# EAGLE design PCB FINAL (EAGLE 9.5.1)
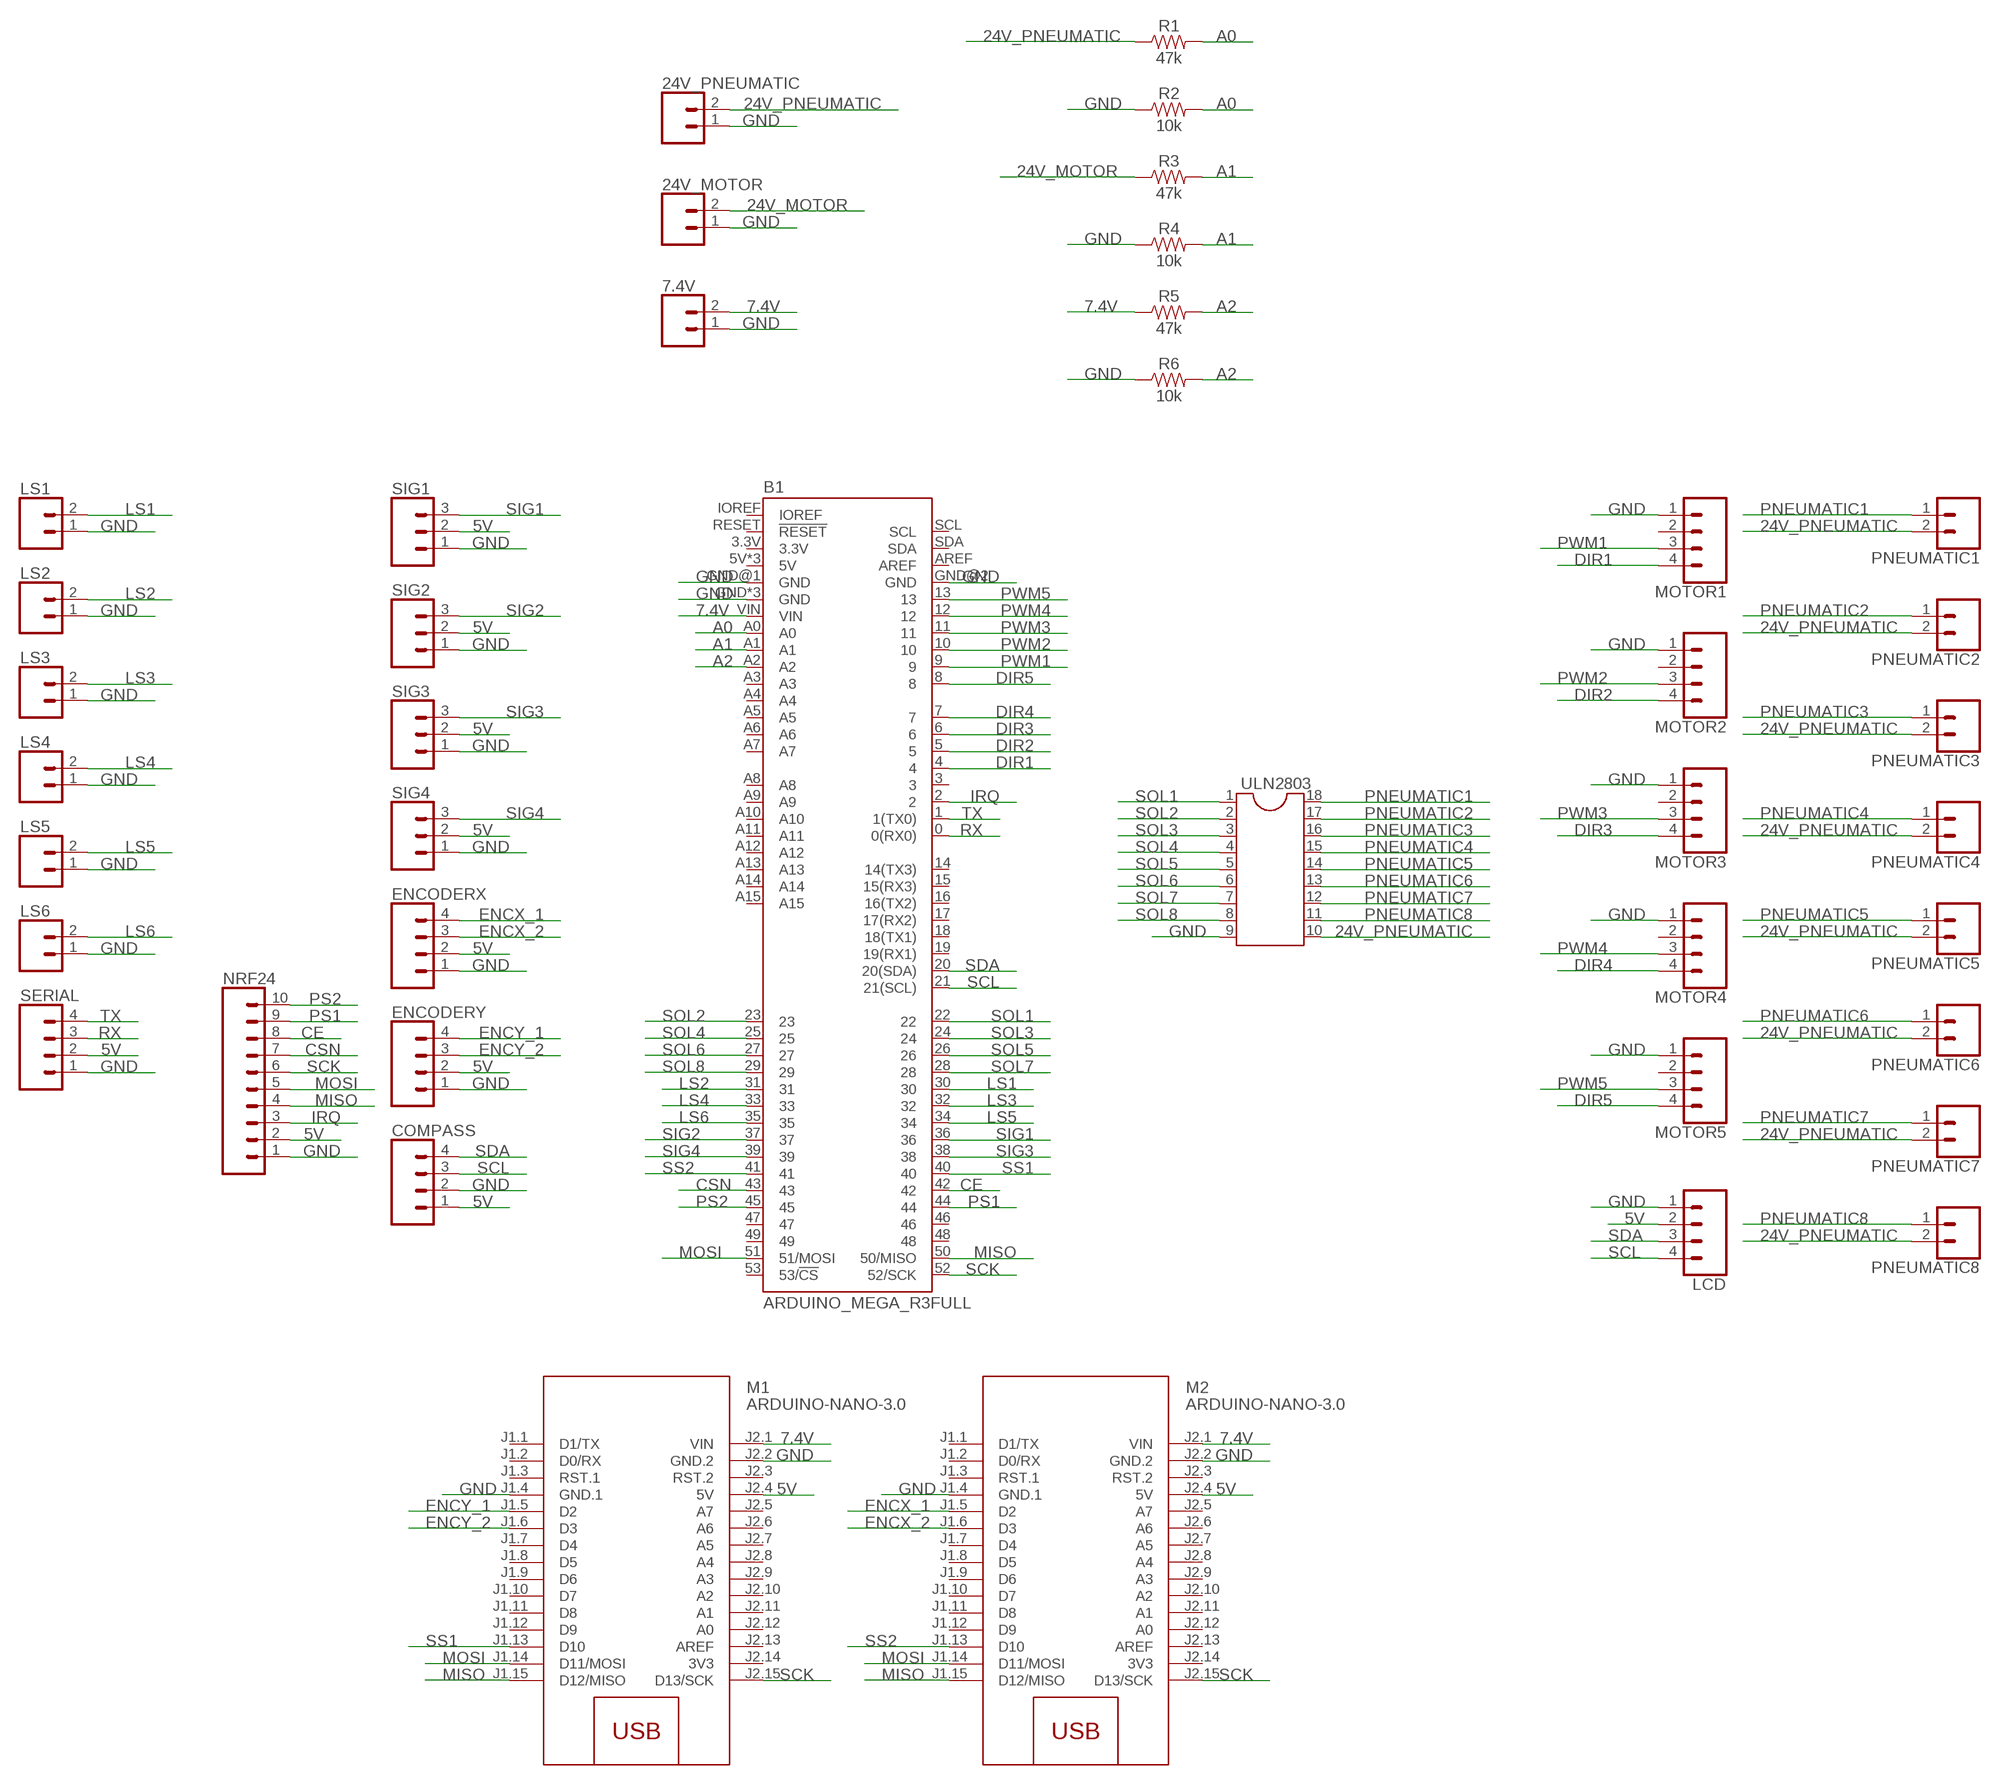
[diagram p0: schematic, sheet 1]

## Parts
7.4V  CONN_02POLAR_LOCK  [MOLEX-1X2_LOCK]
24V_MOTOR  CONN_02POLAR_LOCK  [MOLEX-1X2_LOCK]
24V_PNEUMATIC  CONN_02POLAR_LOCK  [MOLEX-1X2_LOCK]
B1  ARDUINO_MEGA_R3FULL  [ARDUINO_MEGA_NO_SILK]
COMPASS  CONN_04POLAR_LOCK  [MOLEX-1X4_LOCK]
ENCODERX  CONN_04POLAR_LOCK  [MOLEX-1X4_LOCK]
ENCODERY  CONN_04POLAR_LOCK  [MOLEX-1X4_LOCK]
LCD  CONN_04POLAR_LOCK  [MOLEX-1X4_LOCK]
LS1  CONN_02POLAR_LOCK  [MOLEX-1X2_LOCK]
LS2  CONN_02POLAR_LOCK  [MOLEX-1X2_LOCK]
LS3  CONN_02POLAR_LOCK  [MOLEX-1X2_LOCK]
LS4  CONN_02POLAR_LOCK  [MOLEX-1X2_LOCK]
LS5  CONN_02POLAR_LOCK  [MOLEX-1X2_LOCK]
LS6  CONN_02POLAR_LOCK  [MOLEX-1X2_LOCK]
M1  ARDUINO-NANO-3.0  [ARDUINO-NANO-3.0]
M2  ARDUINO-NANO-3.0  [ARDUINO-NANO-3.0]
MOTOR1  CONN_04POLAR_LOCK  [MOLEX-1X4_LOCK]
MOTOR2  CONN_04POLAR_LOCK  [MOLEX-1X4_LOCK]
MOTOR3  CONN_04POLAR_LOCK  [MOLEX-1X4_LOCK]
MOTOR4  CONN_04POLAR_LOCK  [MOLEX-1X4_LOCK]
MOTOR5  CONN_04POLAR_LOCK  [MOLEX-1X4_LOCK]
NRF24  CONN_10LOCK_LONGPADS  [1X10_LOCK_LONGPADS]
PNEUMATIC1  CONN_02POLAR_LOCK  [MOLEX-1X2_LOCK]
PNEUMATIC2  CONN_02POLAR_LOCK  [MOLEX-1X2_LOCK]
PNEUMATIC3  CONN_02POLAR_LOCK  [MOLEX-1X2_LOCK]
PNEUMATIC4  CONN_02POLAR_LOCK  [MOLEX-1X2_LOCK]
PNEUMATIC5  CONN_02POLAR_LOCK  [MOLEX-1X2_LOCK]
PNEUMATIC6  CONN_02POLAR_LOCK  [MOLEX-1X2_LOCK]
PNEUMATIC7  CONN_02POLAR_LOCK  [MOLEX-1X2_LOCK]
PNEUMATIC8  CONN_02POLAR_LOCK  [MOLEX-1X2_LOCK]
R1  47k  100KOHM-HORIZ-1/4W-5%  [AXIAL-0.3]
R2  10k  100KOHM-HORIZ-1/4W-5%  [AXIAL-0.3]
R3  47k  100KOHM-HORIZ-1/4W-5%  [AXIAL-0.3]
R4  10k  100KOHM-HORIZ-1/4W-5%  [AXIAL-0.3]
R5  47k  100KOHM-HORIZ-1/4W-5%  [AXIAL-0.3]
R6  10k  100KOHM-HORIZ-1/4W-5%  [AXIAL-0.3]
SERIAL  CONN_04POLAR_LOCK  [MOLEX-1X4_LOCK]
SIG1  CONN_03POLAR_LOCK  [MOLEX-1X3_LOCK]
SIG2  CONN_03POLAR_LOCK  [MOLEX-1X3_LOCK]
SIG3  CONN_03POLAR_LOCK  [MOLEX-1X3_LOCK]
SIG4  CONN_03POLAR_LOCK  [MOLEX-1X3_LOCK]
ULN2803  DIL18S  [SOCKET-18]

## Nets
5V: COMPASS.1 ENCODERX.2 ENCODERY.2 LCD.2 M1.J2.4(5V) M2.J2.4(5V) NRF24.2 SERIAL.2 SIG1.2 SIG2.2 SIG3.2 SIG4.2
7.4V: 7.4V.2 B1.VIN M1.J2.1(VIN) M2.J2.1(VIN) R5.P$1
24V_MOTOR: 24V_MOTOR.2 R3.P$1
24V_PNEUMATIC: 24V_PNEUMATIC.2 PNEUMATIC1.2 PNEUMATIC2.2 PNEUMATIC3.2 PNEUMATIC4.2 PNEUMATIC5.2 PNEUMATIC6.2 PNEUMATIC7.2 PNEUMATIC8.2 R1.P$1 ULN2803.10
A0: B1.A0 R1.P$2 R2.P$2
A1: B1.A1 R3.P$2 R4.P$2
A2: B1.A2 R5.P$2 R6.P$2
CE: B1.42 NRF24.8
CSN: B1.43 NRF24.7
DIR1: B1.4 MOTOR1.4
DIR2: B1.5 MOTOR2.4
DIR3: B1.6 MOTOR3.4
DIR4: B1.7 MOTOR4.4
DIR5: B1.8 MOTOR5.4
ENCX_1: ENCODERX.4 M2.J1.5(D2)
ENCX_2: ENCODERX.3 M2.J1.6(D3)
ENCY_1: ENCODERY.4 M1.J1.5(D2)
ENCY_2: ENCODERY.3 M1.J1.6(D3)
GND: 7.4V.1 24V_MOTOR.1 24V_PNEUMATIC.1 B1.GND B1.GND@1(GND) B1.GND@2(GND) B1.GND@3(GND) B1.GND@4(GND) COMPASS.2 ENCODERX.1 ENCODERY.1 LCD.1 LS1.1 LS2.1 LS3.1 LS4.1 LS5.1 LS6.1 M1.J1.4(GND.1) M1.J2.2(GND.2) M2.J1.4(GND.1) M2.J2.2(GND.2) MOTOR1.1 MOTOR2.1 MOTOR3.1 MOTOR4.1 MOTOR5.1 NRF24.1 R2.P$1 R4.P$1 R6.P$1 SERIAL.1 SIG1.1 SIG2.1 SIG3.1 SIG4.1 ULN2803.9
IRQ: B1.2 NRF24.3
LS1: B1.30 LS1.2
LS2: B1.31 LS2.2
LS3: B1.32 LS3.2
LS4: B1.33 LS4.2
LS5: B1.34 LS5.2
LS6: B1.35 LS6.2
MISO: B1.50(50/MISO) M1.J1.15(D12/MISO) M2.J1.15(D12/MISO) NRF24.4
MOSI: B1.51(51/MOSI) M1.J1.14(D11/MOSI) M2.J1.14(D11/MOSI) NRF24.5
PNEUMATIC1: PNEUMATIC1.1 ULN2803.18
PNEUMATIC2: PNEUMATIC2.1 ULN2803.17
PNEUMATIC3: PNEUMATIC3.1 ULN2803.16
PNEUMATIC4: PNEUMATIC4.1 ULN2803.15
PNEUMATIC5: PNEUMATIC5.1 ULN2803.14
PNEUMATIC6: PNEUMATIC6.1 ULN2803.13
PNEUMATIC7: PNEUMATIC7.1 ULN2803.12
PNEUMATIC8: PNEUMATIC8.1 ULN2803.11
PS1: B1.44 NRF24.9
PS2: B1.45 NRF24.10
PWM1: B1.9 MOTOR1.3
PWM2: B1.10 MOTOR2.3
PWM3: B1.11 MOTOR3.3
PWM4: B1.12 MOTOR4.3
PWM5: B1.13 MOTOR5.3
RX: B1.0(0(RX0)) SERIAL.3
SCK: B1.52(52/SCK) M1.J2.15(D13/SCK) M2.J2.15(D13/SCK) NRF24.6
SCL: B1.21(21(SCL)) COMPASS.3 LCD.4
SDA: B1.20(20(SDA)) COMPASS.4 LCD.3
SIG1: B1.36 SIG1.3
SIG2: B1.37 SIG2.3
SIG3: B1.38 SIG3.3
SIG4: B1.39 SIG4.3
SOL1: B1.22 ULN2803.1
SOL2: B1.23 ULN2803.2
SOL3: B1.24 ULN2803.3
SOL4: B1.25 ULN2803.4
SOL5: B1.26 ULN2803.5
SOL6: B1.27 ULN2803.6
SOL7: B1.28 ULN2803.7
SOL8: B1.29 ULN2803.8
SS1: B1.40 M1.J1.13(D10)
SS2: B1.41 M2.J1.13(D10)
TX: B1.1(1(TX0)) SERIAL.4
Unconnected: B1.3 B1.3.3V B1.5V B1.5V@1(5V) B1.5V@2(5V) B1.14(14(TX3)) B1.15(15(RX3)) B1.16(16(TX2)) B1.17(17(RX2)) B1.18(18(TX1)) B1.19(19(RX1)) B1.46 B1.47 B1.48 B1.49 B1.53(53/!CS) B1.A3 B1.A4 B1.A5 B1.A6 B1.A7 B1.A8 B1.A9 B1.A10 B1.A11 B1.A12 B1.A13 B1.A14 B1.A15 B1.AREF B1.IOREF B1.RESET(!RESET) B1.SCL B1.SDA M1.J1.1(D1/TX) M1.J1.2(D0/RX) M1.J1.3(RST.1) M1.J1.7(D4) M1.J1.8(D5) M1.J1.9(D6) M1.J1.10(D7) M1.J1.11(D8) M1.J1.12(D9) M1.J2.3(RST.2) M1.J2.5(A7) M1.J2.6(A6) M1.J2.7(A5) M1.J2.8(A4) M1.J2.9(A3) M1.J2.10(A2) M1.J2.11(A1) M1.J2.12(A0) M1.J2.13(AREF) M2.J1.1(D1/TX) M2.J1.2(D0/RX) M2.J1.3(RST.1) M2.J1.7(D4) M2.J1.8(D5) M2.J1.9(D6) M2.J1.10(D7) M2.J1.11(D8) M2.J1.12(D9) M2.J2.3(RST.2) M2.J2.5(A7) M2.J2.6(A6) M2.J2.7(A5) M2.J2.8(A4) M2.J2.9(A3) M2.J2.10(A2) M2.J2.11(A1) M2.J2.12(A0) M2.J2.13(AREF) MOTOR1.2 MOTOR2.2 MOTOR3.2 MOTOR4.2 MOTOR5.2

## Power pins joined to a net without a drawn wire
3V3: M1.J2.14(3V3) M2.J2.14(3V3)

## Library data of the parts
7.4V 24V_MOTOR 24V_PNEUMATIC LS1-LS6 PNEUMATIC1-PNEUMATIC8 = SparkFun-Connectors:CONN_02: Multi connection point. Often used as Generic Header-pin footprint for 0.1 inch spaced/style header connections On any of the 0.1 inch spaced packages, you can populate with these: Break Away Headers - Straight <https://www.sparkfun.com/products/116> (PRT-00116) Break Away Male Headers - Right Angle <https://www.sparkfun.com/products/553> (PRT-00553) Female Headers <https://www.sparkfun.com/products/115> (PRT-00115) Break Away Headers - Machine Pin <https://www.sparkfun.com/products/117> (PRT-00117) Break Away Female Headers - Swiss Machine Pin <https://www.sparkfun.com/products/743> (PRT-00743) For SCREWTERMINALS and SPRING TERMINALS visit here: Screw Terimnals on SparkFun.com <https://www.sparkfun.com/search/results?term=Screw+Terminals> (5mm/3.5mm/2.54mm spacing) This device is also useful as a general connection point to wire up your design to another part of your project. Our various solder wires solder well into these plated through hole pads. Hook-Up Wire - Assortment (Stranded, 22 AWG) <https://www.sparkfun.com/products/11375> (PRT-11375) Hook-Up Wire - Assortment (Solid Core, 22 AWG) <https://www.sparkfun.com/products/11367> (PRT-11367) View the entire wire category on our website here <https://www.sparkfun.com/categories/141> Special notes: Molex polarized connector foot print use with: PRT-08233 with associated crimp pins and housings. 2.54_SCREWTERM for use with PRT-10571. 3.5mm Screw Terminal footprints for PRT-08084 5mm Screw Terminal footprints for use with PRT-08432; SF_ID: PRT-09918
B1 = SparkFun-Boards:ARDUINO_MEGA_R3: Arduino Mega R3 ATmega2560 R3 compatible footprint. SparkFun Products: Arduino Mega 2560 R3 <https://www.sparkfun.com/products/11061>
COMPASS ENCODERX ENCODERY LCD MOTOR1-MOTOR5 SERIAL = SparkFun-Connectors:CONN_04: Multi connection point. Often used as Generic Header-pin footprint for 0.1 inch spaced/style header connections On any of the 0.1 inch spaced packages, you can populate with these: Break Away Headers - Straight <https://www.sparkfun.com/products/116> (PRT-00116) Break Away Male Headers - Right Angle <https://www.sparkfun.com/products/553> (PRT-00553) Female Headers <https://www.sparkfun.com/products/115> (PRT-00115) Break Away Headers - Machine Pin <https://www.sparkfun.com/products/117> (PRT-00117) Break Away Female Headers - Swiss Machine Pin <https://www.sparkfun.com/products/743> (PRT-00743) For SCREWTERMINALS and SPRING TERMINALS visit here: Screw Terimnals on SparkFun.com <https://www.sparkfun.com/search/results?term=Screw+Terminals> (5mm/3.5mm/2.54mm spacing) This device is also useful as a general connection point to wire up your design to another part of your project. Our various solder wires solder well into these plated through hole pads. Hook-Up Wire - Assortment (Stranded, 22 AWG) <https://www.sparkfun.com/products/11375> (PRT-11375) Hook-Up Wire - Assortment (Solid Core, 22 AWG) <https://www.sparkfun.com/products/11367> (PRT-11367) View the entire wire category on our website here <https://www.sparkfun.com/categories/141> Special notes: Molex polarized connector foot print use with SKU : PRT-08231 with associated crimp pins and housings. 1MM SMD Version SKU: PRT-10208; PROD_ID: CONN-08186; SF_ID: PRT-08231
M1 M2 = diy-modules:ARDUINO-NANO-3.0: Arduino Nano 3.0 and compatible devices More details available here: https://www.arduino.cc/en/Main/ArduinoBoardNano Click here to find device on ebay.com <http://www.ebay.com/sch/arduino+nano>
NRF24 = SparkFun-Connectors:CONN_10: Multi connection point. Often used as Generic Header-pin footprint for 0.1 inch spaced/style header connections On any of the 0.1 inch spaced packages, you can populate with these: Break Away Headers - Straight <https://www.sparkfun.com/products/116> (PRT-00116) Break Away Male Headers - Right Angle <https://www.sparkfun.com/products/553> (PRT-00553) Female Headers <https://www.sparkfun.com/products/115> (PRT-00115) Break Away Headers - Machine Pin <https://www.sparkfun.com/products/117> (PRT-00117) Break Away Female Headers - Swiss Machine Pin <https://www.sparkfun.com/products/743> (PRT-00743) Arduino Stackable Header - 10 Pin <https://www.sparkfun.com/products/11376> (PRT-11376) For SCREWTERMINALS and SPRING TERMINALS visit here: Screw Terimnals on SparkFun.com <https://www.sparkfun.com/search/results?term=Screw+Terminals> (5mm/3.5mm/2.54mm spacing) This device is also useful as a general connection point to wire up your design to another part of your project. Our various solder wires solder well into these plated through hole pads. Hook-Up Wire - Assortment (Stranded, 22 AWG) <https://www.sparkfun.com/products/11375> (PRT-11375) Hook-Up Wire - Assortment (Solid Core, 22 AWG) <https://www.sparkfun.com/products/11367> (PRT-11367) View the entire wire category on our website here <https://www.sparkfun.com/categories/141> Special notes: Molex polarized connector foot print use with SKU : PRT-08231 with associated crimp pins and housings. 1MM SMD Version SKU: PRT-10208 NOTES ON THE VARIANTS LOCK and LOCK_LONGPADS... This footprint was designed to help hold the alignment of a through-hole component (i.e. 6-pin header) while soldering it into place. You may notice that each hole has been shifted either up or down by 0.005 of an inch from it's more standard position (which is a perfectly straight line). This slight alteration caused the pins (the squares in the middle) to touch the edges of the holes. Because they are alternating, it causes a "brace" to hold the component in place. 0.005 has proven to be the perfect amount of "off-center" position when using our standard breakaway headers. Although looks a little odd when you look at the bare footprint, once you have a header in there, the alteration is very hard to notice. Also,if you push a header all the way into place, it is covered up entirely on the bottom side.
R1-R6 = SparkFun-Resistors:100KOHM: 100kΩ resistor A resistor is a passive two-terminal electrical component that implements electrical resistance as a circuit element. Resistors act to reduce current flow, and, at the same time, act to lower voltage levels within circuits. - Wikipedia; PROD_ID: RES-10686; VALUE: 100k
SIG1-SIG4 = SparkFun-Connectors:CONN_03: Multi connection point. Often used as Generic Header-pin footprint for 0.1 inch spaced/style header connections On any of the 0.1 inch spaced packages, you can populate with these: Break Away Headers - Straight <https://www.sparkfun.com/products/116> (PRT-00116) Break Away Male Headers - Right Angle <https://www.sparkfun.com/products/553> (PRT-00553) Female Headers <https://www.sparkfun.com/products/115> (PRT-00115) Break Away Headers - Machine Pin <https://www.sparkfun.com/products/117> (PRT-00117) Break Away Female Headers - Swiss Machine Pin <https://www.sparkfun.com/products/743> (PRT-00743) Stackable Header - 3 Pin (Female, 0.1") <https://www.sparkfun.com/products/13875> (PRT-13875) For SCREWTERMINALS and SPRING TERMINALS visit here: Screw Terimnals on SparkFun.com <https://www.sparkfun.com/search/results?term=Screw+Terminals> (5mm/3.5mm/2.54mm spacing) This device is also useful as a general connection point to wire up your design to another part of your project. Our various solder wires solder well into these plated through hole pads. Hook-Up Wire - Assortment (Stranded, 22 AWG) <https://www.sparkfun.com/products/11375> (PRT-11375) Hook-Up Wire - Assortment (Solid Core, 22 AWG) <https://www.sparkfun.com/products/11367> (PRT-11367) View the entire wire category on our website here <https://www.sparkfun.com/categories/141> Special notes: Molex polarized connector foot print use with SKU : PRT-08232 with associated crimp pins and housings.; PROD_ID: CONN-08625; SF_ID: PRT-08096
ULN2803 = ic-package:DIL18: Dual In Line / Socket

## Board
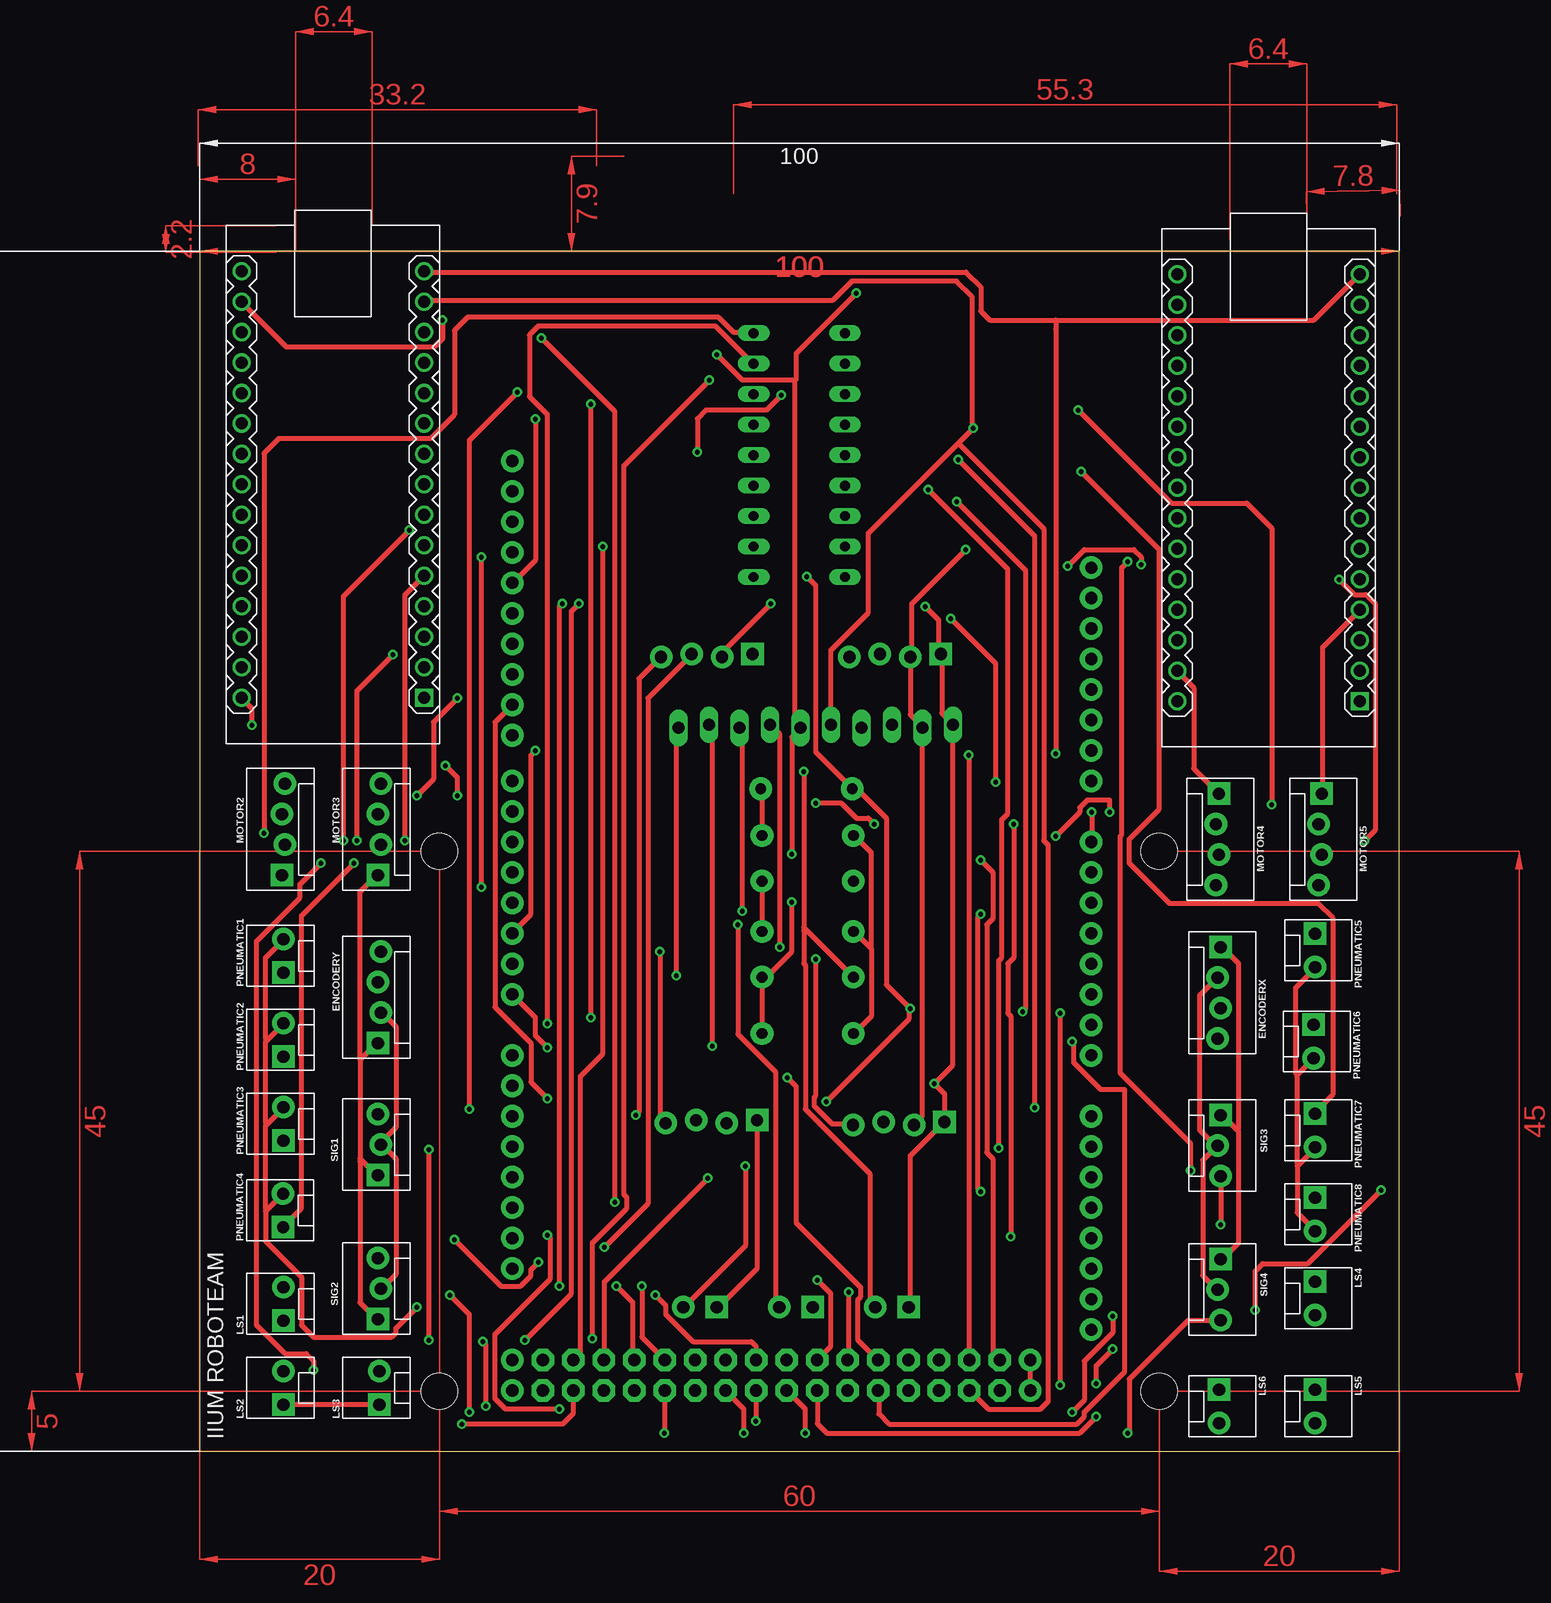
[diagram p1: board, top side]
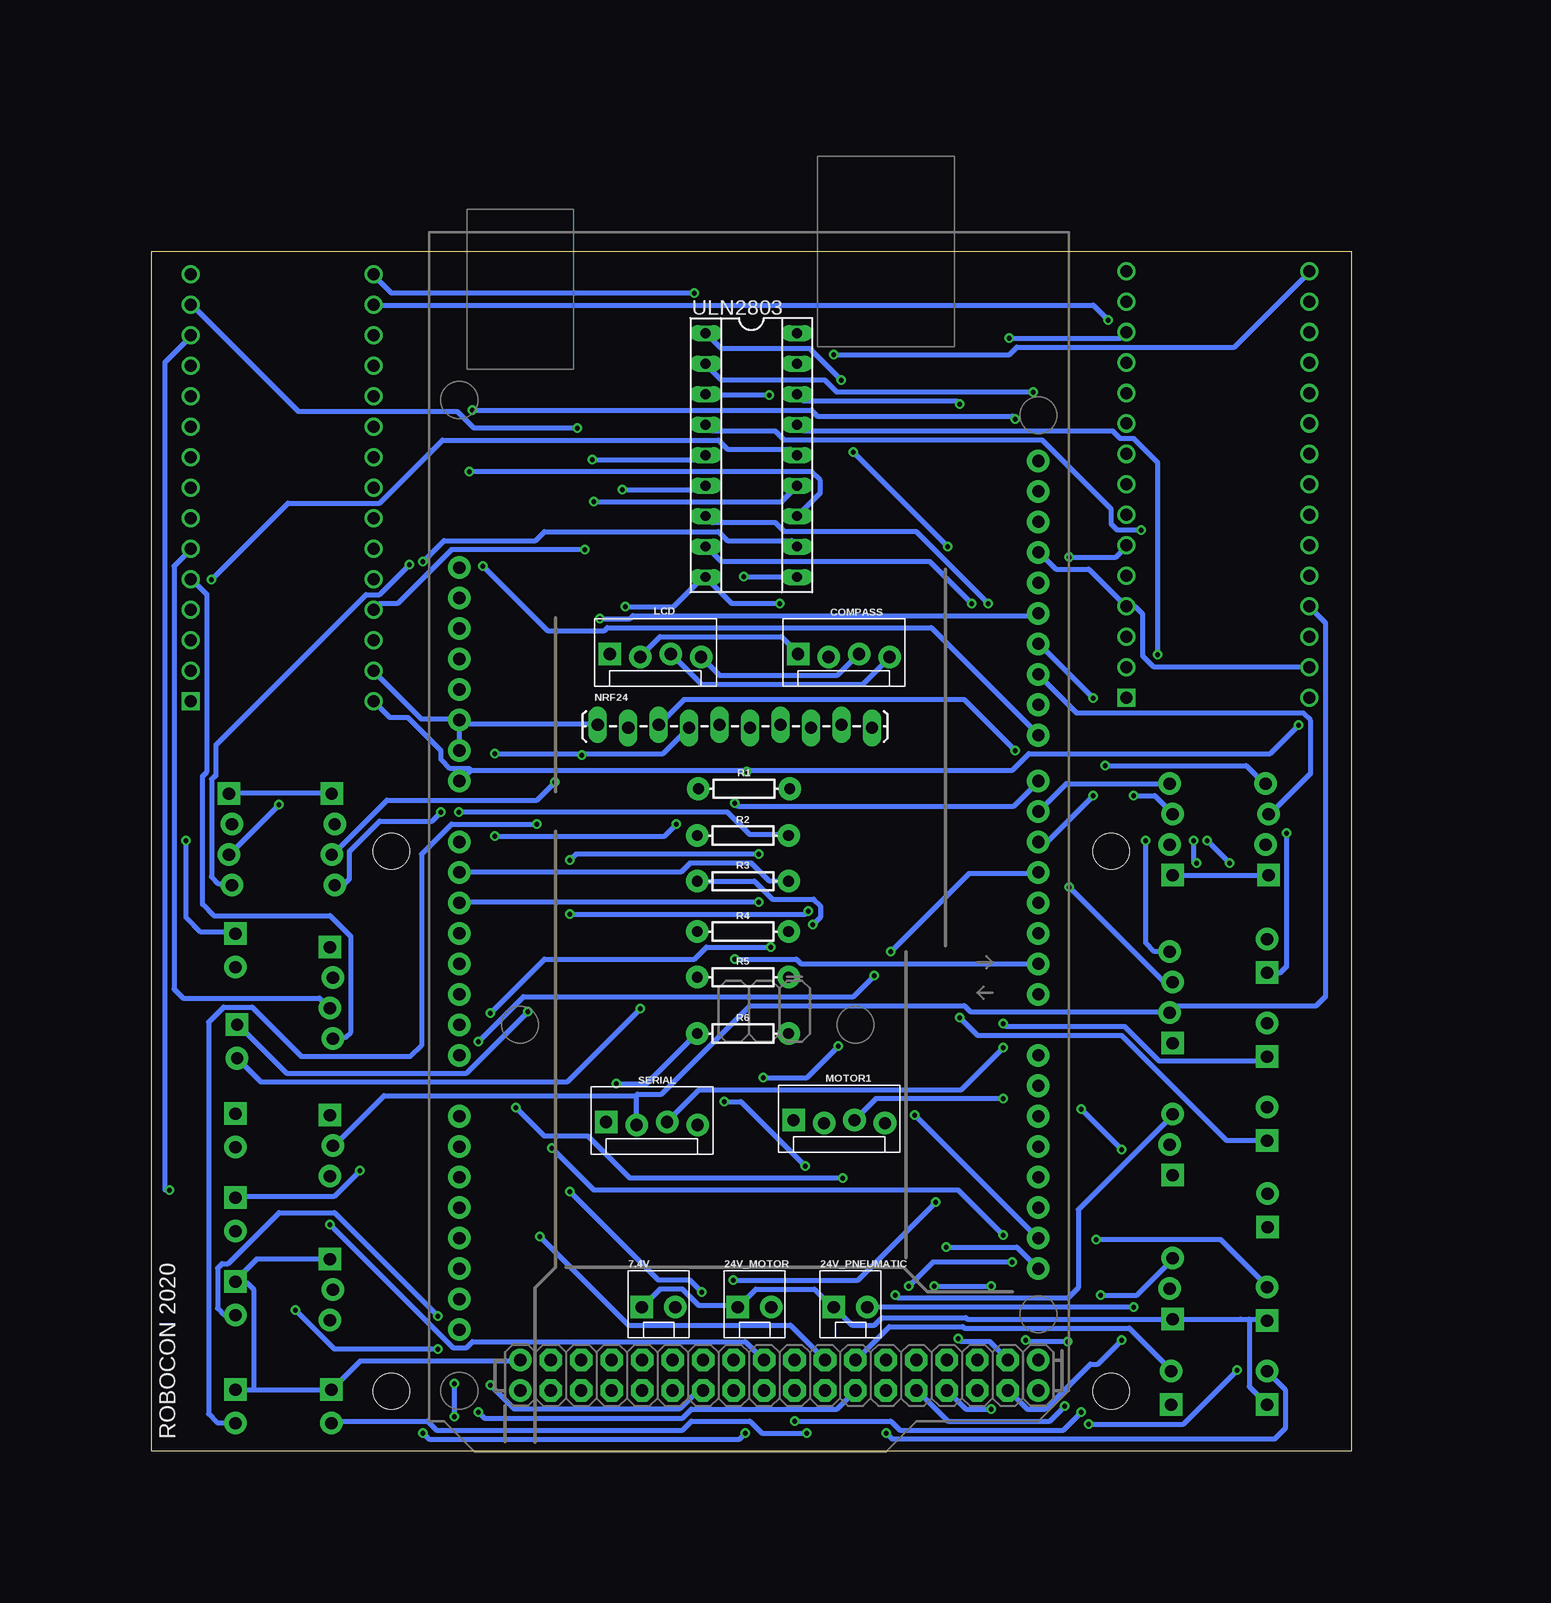
[diagram p2: board, bottom side, seen from below]

Size 100 x 100 mm. Coordinates in mm from the lower left corner, seen from the top.
Outline: 0,0 100,0 100,100 0,100 0,0
Copper layers (1*16): Top 0.3mm / dielectric 1mm / Bottom 0.3mm
Design rules "default *": minimum track width 0.4mm, minimum drill 0.4mm, track to track 0.3mm, track to pad 0.3mm, pad to pad 0.55mm, via to via 0.3mm, smd to smd 0.55mm, copper to edge 30mil, drill to drill 10mil, minimum pad ring 10mil, minimum via ring 8mil, stop-mask expansion 4mil, vias tented up to drill 0mil, thermal gap 10mil
Holes 3 mm at 20,50 80,50 20,5 80,5

### Footprints (pad centres in the part's own frame; a part is rotated, then mirrored left to right if it is on the bottom)
MOLEX-1X2_LOCK = drill 1.016 pad 1.88 square: 1 -0.127,0 | drill 1.016 pad 1.88: 2 2.667,0
ARDUINO_MEGA_NO_SILK = drill 1.016 pad 1.88: 0 13.97,24.13; 1 11.43,24.13; 2 8.89,24.13; 3 6.35,24.13; 3.3V -13.97,-24.13; 4 3.81,24.13; 5 1.27,24.13; 5V -11.43,-24.13; 5V@1 44.45,24.13; 5V@2 46.99,24.13; 6 -1.27,24.13; 7 -3.81,24.13; 8 -7.62,24.13; 9 -10.16,24.13; 10 -12.7,24.13; 11 -15.24,24.13; 12 -17.78,24.13; 13 -20.32,24.13; 14 19.05,24.13; 15 21.59,24.13; 16 24.13,24.13; 17 26.67,24.13; 18 29.21,24.13; 19 31.75,24.13; 20 34.29,24.13; 21 36.83,24.13; A0 1.27,-24.13; A1 3.81,-24.13; A2 6.35,-24.13; A3 8.89,-24.13; A4 11.43,-24.13; A5 13.97,-24.13; A6 16.51,-24.13; A7 19.05,-24.13; A8 24.13,-24.13; A9 26.67,-24.13; A10 29.21,-24.13; A11 31.75,-24.13; A12 34.29,-24.13; A13 36.83,-24.13; A14 39.37,-24.13; A15 41.91,-24.13; AREF -25.4,24.13; GND -8.89,-24.13; GND@1 -6.35,-24.13; GND@2 44.45,-19.05; GND@3 46.99,-19.05; GND@4 -22.86,24.13; IOREF -19.05,-24.13; NC -21.59,-24.13; RESET -16.51,-24.13; SCL -30.48,24.13; SDA -27.94,24.13; VIN -3.81,-24.13 | drill 1.016 pad 1.88 octagon: 22 44.45,21.59; 23 46.99,21.59; 24 44.45,19.05; 25 46.99,19.05; 26 44.45,16.51; 27 46.99,16.51; 28 44.45,13.97; 29 46.99,13.97; 30 44.45,11.43; 31 46.99,11.43; 32 44.45,8.89; 33 46.99,8.89; 34 44.45,6.35; 35 46.99,6.35; 36 44.45,3.81; 37 46.99,3.81; 38 44.45,1.27; 39 46.99,1.27; 40 44.45,-1.27; 41 46.99,-1.27; 42 44.45,-3.81; 43 46.99,-3.81; 44 44.45,-6.35; 45 46.99,-6.35; 46 44.45,-8.89; 47 46.99,-8.89; 48 44.45,-11.43; 49 46.99,-11.43; 50 44.45,-13.97; 51 46.99,-13.97; 52 44.45,-16.51; 53 46.99,-16.51
MOLEX-1X4_LOCK = drill 1.016 pad 1.88 square: 1 0,0.127 | drill 1.016 pad 1.88: 2 2.54,-0.127; 3 5.08,0.127; 4 7.62,-0.127
ARDUINO-NANO-3.0 = drill 1 square: J1.1 17.78,7.62 | drill 1: J1.2 15.24,7.62; J1.3 12.7,7.62; J1.4 10.16,7.62; J1.5 7.62,7.62; J1.6 5.08,7.62; J1.7 2.54,7.62; J1.8 0,7.62; J1.9 -2.54,7.62; J1.10 -5.08,7.62; J1.11 -7.62,7.62; J1.12 -10.16,7.62; J1.13 -12.7,7.62; J1.14 -15.24,7.62; J1.15 -17.78,7.62; J2.1 17.78,-7.62; J2.2 15.24,-7.62; J2.3 12.7,-7.62; J2.4 10.16,-7.62; J2.5 7.62,-7.62; J2.6 5.08,-7.62; J2.7 2.54,-7.62; J2.8 0,-7.62; J2.9 -2.54,-7.62; J2.10 -5.08,-7.62; J2.11 -7.62,-7.62; J2.12 -10.16,-7.62; J2.13 -12.7,-7.62; J2.14 -15.24,-7.62; J2.15 -17.78,-7.62
1X10_LOCK_LONGPADS = drill 1.016 long: 1 0,0.127; 2 2.54,-0.127; 3 5.08,0.127; 4 7.62,-0.127; 5 10.16,0.127; 6 12.7,-0.127; 7 15.24,0.127; 8 17.78,-0.127; 9 20.32,0.127; 10 22.86,-0.127
AXIAL-0.3 = drill 0.9 pad 1.88: P$1 -3.81,0; P$2 3.81,0
MOLEX-1X3_LOCK = drill 1.016 pad 1.88 square: 1 0,0.127 | drill 1.016 pad 1.88: 2 2.54,-0.127; 3 5.08,0.127
SOCKET-18 = drill 0.813 long: 1 -10.16,-3.81; 2 -7.62,-3.81; 3 -5.08,-3.81; 4 -2.54,-3.81; 5 0,-3.81; 6 2.54,-3.81; 7 5.08,-3.81; 8 7.62,-3.81; 9 10.16,-3.81; 10 10.16,3.81; 11 7.62,3.81; 12 5.08,3.81; 13 2.54,3.81; 14 0,3.81; 15 -2.54,3.81; 16 -5.08,3.81; 17 -7.62,3.81; 18 -10.16,3.81

### Placement (x,y rotation side)
7.4V  59,12 0 bottom
24V_MOTOR  51,12 0 bottom
24V_PNEUMATIC  43,12 0 bottom
B1  50.21,52.04 270 bottom
COMPASS  46.1,66.3 0 bottom
ENCODERX  85,42 270 top
ENCODERY  15,34 90 top
LCD  61.8,66.3 0 bottom
LS1  7,11 90 top
LS2  7,4 90 top
LS3  15,4 90 top
LS4  93,14 270 top
LS5  93,5 270 top
LS6  85,5 270 top
M1  11.12,80.56 270 top
M2  89.12,80.28 270 top
MOTOR1  46.48,27.46 0 bottom
MOTOR2  7,48 90 top
MOTOR3  15,48 90 top
MOTOR4  84.85,54.79 270 top
MOTOR5  93.42,54.79 270 top
NRF24  62.8,60.4 0 bottom
PNEUMATIC1  7,40 90 top
PNEUMATIC2  7,33 90 top
PNEUMATIC3  7,26 90 top
PNEUMATIC4  6.97,18.79 90 top
PNEUMATIC5  93,43 270 top
PNEUMATIC6  92.87,35.41 270 top
PNEUMATIC7  93,28 270 top
PNEUMATIC8  93,21 270 top
R1  50.6,55.2 0 bottom
R2  50.7,51.3 0 bottom
R3  50.7,47.5 0 bottom
R4  50.7,43.3 0 bottom
R5  50.7,39.5 0 bottom
R6  50.7,34.8 0 bottom
SERIAL  62.1,27.3 0 bottom
SIG1  15,23 90 top
SIG2  15,11 90 top
SIG3  85,28 270 top
SIG4  85,16 270 top
ULN2803  50,83 270 bottom

### Tracks (layer width: path | path; a pad name or v marks a point on that pad's centre or on a via)
3V3  (via drill 0.4)
  Top 0.4: v20.25,94.25 20.25,92.7 19.55,92 7.25,92 3.5,95.75 M1.J2.14
  Bottom 0.4: v20.25,94.25 21.5,95.5 81.5,95.5 M2.J2.14
5V  (via drill 0.4)
  Top 0.4: SIG2.2 15.25,13.62 16.38,14.75 16.38,24.38 15.25,25.5 SIG1.2 15.12,25.75 16.38,27 16.38,35.38 15.25,36.5 ENCODERY.2 | v63.88,75.12 59.38,70.62 59.38,66.25 LCD.2 59.25,66 59.25,61.38 60.25,60.38 NRF24.2 60.25,60.12 60.25,27.88 59.62,27.25 SERIAL.2 | SIG4.2 84.75,13.5 83.62,14.62 83.62,24.25 84.75,25.38 SIG3.2 84.62,25.5 83.38,26.75 83.38,38 84.75,39.38 ENCODERX.2
  Bottom 0.4: M1.J2.4 3.5,70.38 2.12,69 2.12,37.9 2.9,37.12 14.62,37.12 15.12,36.62 ENCODERY.2 15.25,36.62 31.75,36.62 32.25,37.12 50.12,37.12 57.5,29.75 59.5,29.75 59.62,29.62 | v63.88,75.12 75,75.12 79.5,70.62 81,70.62 M2.J2.4 | COMPASS.1 46.12,66.5 47.5,67.88 57.62,67.88 59.25,66.25 LCD.2 | 59.62,29.62 59.62,27.25 SERIAL.2 | 59.62,29.62 80.62,29.62 84.75,25.5 SIG3.2
7.4V  (via drill 0.4)
  Top 0.4: v4.38,60.5 4.38,61.88 3.5,62.75 M1.J2.1 | 50.5,43.5 50.38,43.62 v50.38,56.62 | 50.5,43.5 R5.P$1 | 7.4V.2 56.25,12 55.88,12.38 55.88,23.12 50.5,28.5 50.5,40.5 50.38,40.62 50.38,43.38 50.5,43.5
  Bottom 0.4: v4.38,60.5 6.75,58.12 26.88,58.12 28.25,56.75 50.38,56.75 | 73.38,56.75 50.38,56.75 | 73.38,56.75 74.25,55.88 B1.VIN | M2.J2.1 80.12,61.12 78.62,61.12 75.88,58.38 75.88,57.65 75.1,56.88 73.5,56.88 73.38,56.75 | v50.38,56.62 50.38,56.75
24V_MOTOR  (via drill 0.4)
  Top 0.4: v44.88,43.88 44.88,34.75 48,31.62 48,12.25 48.25,12 24V_MOTOR.2
  Bottom 0.4: v44.88,43.88 44.25,44.5 44.25,45.45 44.8,46 48.25,46 49.75,47.5 R3.P$1
24V_PNEUMATIC  (via drill 0.4)
  Top 0.4: v18.12,12 16.38,10.25 16.38,9.88 16,9.5 9.5,9.5 8.5,10.5 8.5,14.5 5.5,17.5 5.5,20 5.62,20.12 | 5.62,20.12 6.88,21.38 PNEUMATIC4.2 | 5.62,27.25 5.5,27.12 5.5,20.25 5.62,20.12 | 5.62,27.25 7,28.62 PNEUMATIC3.2 | 5.62,34.25 5.5,34.12 5.5,27.38 5.62,27.25 | 5.62,34.25 7,35.62 PNEUMATIC2.2 | PNEUMATIC1.2 7,42.62 5.5,41.12 5.5,34.38 5.62,34.25 | 91.62,23.88 93,25.25 PNEUMATIC7.2 | 91.62,23.88 91.5,23.75 91.5,19.88 93,18.38 PNEUMATIC8.2 | 91.5,31.38 92.75,32.62 PNEUMATIC6.2 | 91.5,31.38 91.5,24 91.62,23.88 | PNEUMATIC5.2 93,40.25 91.38,38.62 91.38,31.5 91.5,31.38 | v50.62,72.88 51.38,72.12 51.38,58.25 54.38,55.25 R1.P$1 54.5,55.12 54.88,55.12 57.25,52.75 57.25,38.88 v59.25,36.88 59.12,36.75 59.12,36 v52.25,29.12 | v45.5,23.75 45.5,17.12 40.38,12 24V_PNEUMATIC.2
  Bottom 0.4: v18.12,12 24V_PNEUMATIC.2 | v50.62,72.88 46.25,72.88 ULN2803.10 | v59.25,36.88 65.38,30.75 90.88,30.75 92.75,32.62 PNEUMATIC6.2 | v45.5,23.75 50.88,29.12 v52.25,29.12
A0  (via drill 0.4)
  Top 0.4: R2.P$2 46.88,51.38 46.88,55.12 R1.P$2 | v74.38,53.25 74.38,50.88 B1.A0
  Bottom 0.4: v74.38,53.25 52,53.25 50.12,51.38 47,51.38 R2.P$2
A1
  Top 0.4: R4.P$2 46.88,43.38 46.88,47.5 R3.P$2
  Bottom 0.4: R3.P$2 48.5,47.5 50,49 55.12,49 55.88,48.25 74.25,48.25 B1.A1
A2  (via drill 0.4)
  Top 0.4: R6.P$2 46.88,34.88 46.88,39.5 R5.P$2 47,39.25 49.38,41.62 v49.38,45.75
  Bottom 0.4: v49.38,45.75 74.25,45.75 B1.A2
CE  (via drill 0.4)
  Top 0.4: v45.25,45 45.25,60.12 45.12,60.25 NRF24.8 | v65.12,44.75 64.88,44.5 64.88,21.88 v65.12,21.62 | v54.12,13.25 54.12,7.62 B1.42
  Bottom 0.4: v45.25,45 45.5,44.75 v65.12,44.75 | v65.12,21.62 57.75,14.25 55.12,14.25 v54.12,13.25
CSN  (via drill 0.4)
  Top 0.4: v48.38,42 48.38,59.75 47.62,60.5 NRF24.7 | v71.75,5.5 v71.75,36.5
  Bottom 0.4: v48.38,42 53.75,42 54.75,41 67.25,41 v71.75,36.5 | v71.75,5.5 69.75,3.5 56,3.5 54.5,5 54.12,5 B1.43
DIR1  (via drill 0.4)
  Top 0.4: v38.38,41.62 38.38,27.75 38.75,27.38 MOTOR1.4
  Bottom 0.4: v38.38,41.62 31.88,48.12 26.12,48.12 B1.4
DIR2  (via drill 0.4)
  Top 0.4: v20.5,57.12 21.5,56.12 v21.5,54.62
  Bottom 0.4: v20.5,57.12 8.75,57.12 7.25,55.62 MOTOR2.4 | v21.5,54.62 25.25,50.88 26,50.88 B1.5
DIR3
  Bottom 0.4: MOTOR3.4 15.25,55.62 23.75,55.62 26,53.38 B1.6
DIR4  (via drill 0.4)
  Top 0.4: v51.38,54 53.5,54 54.75,52.75 55.75,52.75 v56.25,52.25 | v71.38,51.25 73.38,53.25 73.38,53.62 74,54.25 75.88,54.25 v75.88,53.25
  Bottom 0.4: v51.38,54 51.12,53.75 28.12,53.75 26.12,55.75 B1.7 | v56.25,52.25 57.25,51.25 v71.38,51.25 | v75.88,53.25 76.62,52.5 81,52.5 83.5,50 83.5,47.7 84.03,47.17 MOTOR4.4
DIR5  (via drill 0.4)
  Top 0.4: v72.38,73.75 73.75,75.12 77.9,75.12 78.5,74.53 v78.5,73.88
  Bottom 0.4: v72.38,73.75 67,68.38 62.25,68.38 62,68.62 35,68.62 26.12,59.75 B1.8 | v78.5,73.88 81,71.38 82.12,71.38 94.62,58.88 94.62,56.25 94.75,56.25 95,56 95,47.9 95,47.85 94.4,47.25 93.38,47.25 MOTOR5.4
ENCX_1
  Bottom 0.4: M2.J1.5 96.62,72.62 95.38,71.38 95.38,56.62 95.75,56.25 95.75,45.58 94.8,44.62 85.12,44.62 83.38,42.88 83.38,34.92 83.8,34.5 84.75,34.5 ENCODERX.4
ENCX_2
  Bottom 0.4: M2.J1.6 96.75,75.12 98.12,73.75 98.12,38.5 97.38,37.75 86,37.75 85.25,37 ENCODERX.3
ENCY_1  (via drill 0.4)
  Top 0.4: v17.12,50.88 17.12,71.38 18.62,72.88 M1.J1.5
  Bottom 0.4: ENCODERY.4 15.25,41.62 16.4,41.62 17.12,42.35 v17.12,50.88
ENCY_2  (via drill 0.4)
  Top 0.4: v23.5,47 v23.5,74.5
  Bottom 0.4: v23.5,74.5 19.62,74.5 18.75,75.38 M1.J1.6 | v23.5,47 15.62,39.12 14.88,39.12 ENCODERY.3
GND  (via drill 0.4)
  Top 0.4: LS2.1 LS3.1 | 13.5,24.25 13.38,24.38 13.38,32.62 13.5,32.75 | 13.5,24.25 14.75,23 SIG1.1 | 13.5,32.75 14.75,34 ENCODERY.1 | MOTOR3.1 14.75,48 13.38,46.62 13.38,32.88 13.5,32.75 | SIG2.1 14.75,11 13.38,12.38 13.38,24.12 13.5,24.25 | 55.88,42 54.62,43.25 R4.P$1 | 55.88,42 56,41.88 56,36.25 54.62,34.88 R6.P$1 | R2.P$1 54.62,51.25 56,49.88 56,42.12 55.88,42 | MOTOR1.1 46.5,27.5 46.5,15.25 43.25,12 24V_PNEUMATIC.1 | 7.4V.1 59.25,12 59.25,24.62 62,27.38 SERIAL.1 62.12,27.62 62.12,29.75 v61.25,30.62 62.75,32.12 62.75,60.38 NRF24.1 62.75,60.62 61.88,61.5 61.88,66.38 LCD.1 61.62,66.5 61.62,69.25 v60.5,70.38 | 86.5,26.75 86.62,26.62 86.62,17.38 85.25,16 SIG4.1 | 86.5,26.75 85.25,28 SIG3.1 | ENCODERX.1 85.25,42 86.62,40.62 86.62,26.88 86.5,26.75 | M2.J1.4 96.62,70 93.62,67 93.62,54.88 MOTOR5.1 | v47.62,70.62 43.62,66.62 43.62,66.25 COMPASS.2 | B1.GND@2 69.25,7.5 69.25,5.12 B1.GND@3 | MOTOR4.1 84.88,54.88 82.88,56.88 82.88,63.62 81.5,65 M2.J2.2
  Bottom 0.4: 8.5,11 9.2,11 SIG2.1 32,11 32.12,11.12 39.12,11.12 39.75,10.5 41.62,10.5 43,11.88 24V_PNEUMATIC.1 43.25,12 44.75,13.5 49.62,13.5 24V_MOTOR.1 51.25,12.12 54.38,12.12 55.75,13.5 57.62,13.5 7.4V.1 | 8.5,11 7.12,11 LS1.1 | 8.5,11 8.5,5.38 LS2.1 | MOTOR3.1 MOTOR2.1 | v61.25,30.62 58.75,30.62 54.62,34.75 R6.P$1 | 91.5,5.12 LS5.1 | 91.5,5.12 LS6.1 84.88,5.25 82.62,7.5 69.38,7.5 B1.GND@2 | SIG4.1 91.25,16 93,14.25 LS4.1 92.88,14 92,14 91.5,13.5 91.5,5.12 | MOTOR4.1 85,54.88 93.5,54.88 MOTOR5.1 | M1.J2.2 3.5,65.38 16.5,65.38 17.38,66.25 17.38,69.75 18,70.38 18.62,70.38 M1.J1.4 18.88,70.5 21.88,73.5 24.62,73.5 26,74.88 B1.GND@4 | v47.62,70.62 51.62,70.62 53.75,72.75 ULN2803.9 54,72.88 56.5,70.38 v60.5,70.38 | M2.J2.2 81.5,65 77.5,61 74.38,61 B1.GND | B1.GND@1 74.38,58.5 74.38,60.75 B1.GND | NRF24.1 62.88,60.62 74.25,60.62 B1.GND
IRQ  (via drill 0.4)
  Top 0.4: v28,58.38 27.62,58 27.62,44.75 26.12,43.25 B1.2
  Bottom 0.4: v28,58.38 32.25,62.62 55.62,62.62 57.62,60.62 NRF24.3
LS1  (via drill 0.4)
  Top 0.4: v36.88,13.75 36.88,9.5 38.75,7.62 B1.30 | v28.25,15.75 27.62,15.12 27.62,14.62 26.75,13.75 25.12,13.75 v21.25,17.62
  Bottom 0.4: v36.88,13.75 34.88,15.75 v28.25,15.75 | v21.25,17.62 10.88,17.62 7,13.75 LS1.2
LS2  (via drill 0.4)
  Top 0.4: v38.75,1.5 38.75,5 B1.31
  Bottom 0.4: v38.75,1.5 38.25,1 6.4,1 5.5,1.9 5.5,5.12 7,6.62 LS2.2
LS3
  Bottom 0.4: LS3.2 15,6.75 18.5,10.25 32.25,10.25 32.38,10.38 38.5,10.38 41.25,7.62 B1.32
LS4  (via drill 0.4)
  Top 0.4: v72.75,3.25 73.75,4.25 73.75,7.5 76.12,9.88 v76.12,11.25
  Bottom 0.4: v72.75,3.25 72.25,2.75 55.75,2.75 55,3.5 42.88,3.5 41.38,5 B1.33 | v76.12,11.25 84.75,19.88 89.38,19.88 93.62,15.62 94.12,15.62 94.5,15.25 94.5,11.9 93.97,11.38 93,11.38 LS4.2
LS5  (via drill 0.4)
  Top 0.4: v67.62,17.88 67.62,36.25 67.38,36.5 67.38,40.62 67.88,41.12 v67.88,52.25
  Bottom 0.4: v67.62,17.88 60.25,10.5 46.75,10.5 43.88,7.62 B1.34 | v67.88,52.25 75,52.25 77.5,49.75 77.5,33.8 78.42,32.88 87.5,32.88 91.62,37 94,37 95.25,35.75 95.25,3.1 94.53,2.38 93,2.38 LS5.2
LS6  (via drill 0.4)
  Top 0.4: v45.38,1.5 45.38,3.5 43.88,5 B1.35
  Bottom 0.4: v45.38,1.5 49.12,1.5 50.12,2.5 55,2.5 55.75,1.75 76.25,1.75 77,2.5 84.88,2.5 85,2.38 LS6.2
MISO  (via drill 0.4)
  Top 0.4: 71.38,94.25 92.88,94.25 96.62,98 M2.J1.15 | M1.J1.15 18.75,98.25 63.9,98.25 65.12,97.03 65.12,95 65.88,94.25 71.38,94.25 | 71.38,94.25 71.38,93.5 v71.38,58.12 | v64.12,58 64.12,7.62 B1.50
  Bottom 0.4: v71.38,58.12 64.12,58.12 | 64.12,58.12 57.38,58.12 55.25,60.25 NRF24.4 | v64.12,58 64.12,58.12
MOSI  (via drill 0.4)
  Top 0.4: 63.25,84 55.75,76.5 55.75,69.88 52.62,66.75 52.62,60.62 NRF24.5 | 63.25,84 v64.5,85.25 64.38,85.38 64.38,96.22 63.1,97.5 54.38,97.5 52.75,95.88 18.75,95.88 M1.J1.14 | 63.25,84 70.38,76.88 70.38,50.88 70.75,50.5 70.75,4.15 70.1,3.5 65.75,3.5 64.25,5 B1.51
  Bottom 0.4: v64.5,85.25 73.12,85.25 74.5,86.62 87.75,86.62 96.62,95.5 M2.J1.14
PNEUMATIC1  (via drill 0.4)
  Top 0.4: ULN2803.18 46.12,93.25 44.5,93.25 43.25,94.5 22.35,94.5 21.25,93.4 21.25,86.38 19.25,84.38 6.6,84.38 5.38,83.15 v5.38,51.5
  Bottom 0.4: PNEUMATIC1.1 5.9,39.88 5.38,40.4 v5.38,51.5
PNEUMATIC2  (via drill 0.4)
  Top 0.4: v29,35.62 29,86.38 27.5,87.88 27.5,93.03 28.22,93.75 43,93.75 46.12,90.62 ULN2803.17
  Bottom 0.4: v29,35.62 28.75,35.38 18.88,35.38 16,32.5 7.25,32.5 7,32.75 PNEUMATIC2.1
PNEUMATIC3  (via drill 0.4)
  Top 0.4: v32.62,36.12 v32.62,87.25
  Bottom 0.4: v32.62,87.25 32.88,87.5 45.62,87.5 46.12,88 ULN2803.16 | v32.62,36.12 31.12,34.62 19.12,34.62 10.38,25.88 PNEUMATIC3.1
PNEUMATIC4  (via drill 0.4)
  Top 0.4: v16.12,66.38 13.12,63.38 v13.12,50.88 | v12.88,49 8.5,44.62 8.5,20.25 7,18.75 PNEUMATIC4.1
  Bottom 0.4: v16.12,66.38 16.12,82.38 18.12,84.38 19.25,84.38 19.88,85 45.62,85 46.12,85.5 ULN2803.15 | v13.12,50.88 13.12,49 v12.88,49
PNEUMATIC5  (via drill 0.4)
  Top 0.4: v95,72.62 96.25,71.38 97.2,71.38 97.2,71.37 97.26,71.37 98,70.63 98,51.75 v97.12,50.88
  Bottom 0.4: v95,72.62 88.62,79 81,79 75.75,84.25 52.75,84.25 52,83.5 46.75,83.5 46.25,83 ULN2803.14 | PNEUMATIC5.1 93,43.25 95.9,43.25 97.12,44.47 v97.12,50.88
PNEUMATIC6  (via drill 0.4)
  Top 0.4: v63.12,79.12 68.88,73.38 68.88,36.88 v68.62,36.62
  Bottom 0.4: v63.12,79.12 47.5,79.12 46.25,80.38 ULN2803.13 | v68.62,36.62 73.75,31.5 88.75,31.5 92.75,35.5 PNEUMATIC6.1
PNEUMATIC7  (via drill 0.4)
  Top 0.4: v73.5,81.62 80,75.12 80,53.5 77.5,51 77.5,49 80.88,45.62 93.28,45.62 94.5,44.4 94.5,29.75 93,28.25 PNEUMATIC7.1
  Bottom 0.4: ULN2803.12 46.12,78 44.25,79.88 44.25,80.9 44.98,81.62 v73.5,81.62
PNEUMATIC8  (via drill 0.4)
  Top 0.4: v77.38,74.12 76.88,73.62 76.88,51.38 76.75,51.25 76.75,31.5 82.62,25.62 v82.62,23.38
  Bottom 0.4: v77.38,74.12 75.62,75.88 68,75.88 67.25,76.62 52.75,76.62 52,75.88 46.62,75.88 46.25,75.5 ULN2803.11 | v82.62,23.38 84.75,21.25 93,21.25 PNEUMATIC8.1
PS1  (via drill 0.4)
  Top 0.4: v42.75,33.75 42.75,60.25 42.5,60.5 NRF24.9 | v49,31.12 49.75,30.38 49.75,19 55.12,13.62 55.12,12.88 54.88,12.62 54.88,9.25 56.5,7.62 B1.44
  Bottom 0.4: v42.75,33.75 45.38,31.12 v49,31.12
PS2  (via drill 0.4)
  Top 0.4: v39.75,39.62 39.75,60.12 39.88,60.25 NRF24.10 | v72.75,34.12 72.88,34 72.88,32.38 75.12,30.12 77.12,30.12 77.12,6.62 73.75,3.25 73.75,2.88 73.12,2.25 57.48,2.25 56.62,3.1 56.62,5 B1.45
  Bottom 0.4: v39.75,39.62 41.5,37.88 69,37.88 v72.75,34.12
PWM1  (via drill 0.4)
  Top 0.4: v29,29.38 27.62,30.75 27.62,34 24.62,37 24.62,60.75 26,62.12 B1.9
  Bottom 0.4: v29,29.38 39.62,29.38 41.38,27.62 MOTOR1.3
PWM2
  Bottom 0.4: MOTOR2.3 6.75,53.12 3.38,56.5 3.38,60.9 3.98,61.5 22.88,61.5 26,64.62 B1.10
PWM3  (via drill 0.4)
  Top 0.4: v18.12,54.62 19.5,56 19.5,60.75 v21.5,62.75
  Bottom 0.4: v18.12,54.62 16.38,54.62 14.88,53.12 MOTOR3.3 | v21.5,62.75 26,67.25 B1.11
PWM4  (via drill 0.4)
  Top 0.4: v62.62,69.38 66.38,65.62 v66.38,55.75
  Bottom 0.4: v62.62,69.38 60.12,69.38 59.88,69.62 26.25,69.62 26.12,69.75 B1.12 | v66.38,55.75 67.88,54.25 80.38,54.25 84.88,49.75 MOTOR4.3
PWM5  (via drill 0.4)
  Top 0.4: v28,86 28,74.25 26.12,72.38 B1.13 | v73.25,86.75 81,79 87.3,79 89.38,76.93 v89.38,53.88
  Bottom 0.4: v28,86 28.25,86.25 44.5,86.25 45,86.75 v73.25,86.75 | v89.38,53.88 93.5,49.75 MOTOR5.3
RX  (via drill 0.4)
  Top 0.4: v29,33.62 28,34.62 28,36.12 26.12,38 B1.0
  Bottom 0.4: v29,33.62 32.5,30.12 54.38,30.12 57,27.5 SERIAL.3
SCK  (via drill 0.4)
  Top 0.4: v43.12,91.38 45.25,89.25 49.62,89.25 | 49.62,89.25 49.62,60.75 50,60.38 NRF24.6 50,60.12 49.38,59.5 v49.38,49.75 | v54.75,96.5 49.75,91.5 49.75,89.38 49.62,89.25 | v65.12,49.25 66.12,48.25 66.12,44.38 65.62,43.88 65.62,24.88 66.12,24.38 66.12,8.12 66.62,7.62 B1.52
  Bottom 0.4: v43.12,91.38 28.5,91.38 27.88,92 9.75,92 3.5,98.25 M1.J2.15 | v54.75,96.5 80,96.5 81.5,98 M2.J2.15 | v65.12,49.25 64.62,49.75 v49.38,49.75
SCL  (via drill 0.4)
  Top 0.4: v33.75,17 37.38,20.62 37.38,62.75 41,66.38 COMPASS.3
  Bottom 0.4: v33.75,17 27.88,17 26.12,15.25 B1.21 | LCD.4 54.12,66.12 52.62,64.62 42.88,64.62 41.12,66.38 COMPASS.3
SDA  (via drill 0.4)
  Top 0.4: v36.38,28 36.62,28.25 36.62,64.38 38.38,66.12 COMPASS.4
  Bottom 0.4: v36.38,28 26.12,17.75 B1.20 | LCD.3 56.62,66.38 54.12,63.88 40.75,63.88 38.5,66.12 COMPASS.4
SIG1  (via drill 0.4)
  Top 0.4: v38,13 38.88,12.12 38.88,11.38 41.12,9.12 46,9.12 46.38,8.75 46.38,7.62 B1.36
  Bottom 0.4: v38,13 37.75,12.75 23.6,12.75 22.75,13.6 22.75,20.12 14.88,28 SIG1.3
SIG2  (via drill 0.4)
  Top 0.4: v20.88,13 22.5,11.38 v22.5,3.25 | v46.38,2.5 46.38,5 B1.37
  Bottom 0.4: v20.88,13 17.88,13 14.88,16 SIG2.3 | v22.5,3.25 24,1.75 37.62,1.75 38.38,2.5 v46.38,2.5
SIG3  (via drill 0.4)
  Top 0.4: v85.12,18.88 85.12,22.88 SIG3.3
  Bottom 0.4: v85.12,18.88 74.88,8.62 73.75,8.62 73.25,9.12 50.5,9.12 49,7.62 B1.38
SIG4  (via drill 0.4)
  Top 0.4: v50.5,1.5 50.5,3.5 49,5 B1.39 | v77.38,1.5 77.5,1.62 77.5,6 82.38,10.88 85.12,10.88 SIG4.3
  Bottom 0.4: v50.5,1.5 51,1 76.88,1 v77.38,1.5
SOL1  (via drill 0.4)
  Top 0.4: v42.5,89.25 35.38,82.12 35.38,21.38 35.62,21.12 35.62,20.25 32.75,17.38 v32.75,9.38
  Bottom 0.4: v42.5,89.25 45.12,91.88 52.5,91.88 53.75,93.12 ULN2803.1 | v32.75,9.38 32.5,9.12 30.12,9.12 28.62,7.62 B1.22
SOL2  (via drill 0.4)
  Top 0.4: v26.5,88.25 22.5,84.25 v22.5,28.5 | v19.12,9.25 v19.12,25.12
  Bottom 0.4: v26.5,88.25 42.88,88.25 43.88,89.25 52.5,89.25 53.75,90.5 ULN2803.2 | v19.12,25.12 v22.5,28.5 | v19.12,9.25 21.12,7.25 21.75,7.25 25.5,3.5 27,3.5 28.5,5 B1.23
SOL3  (via drill 0.4)
  Top 0.4: v48.5,88 47.25,86.75 42.2,86.75 41.5,86.05 v41.5,83.25 | v33.62,75.38 33.62,33.12 31.75,31.25 31.75,8.12 31.25,7.62 B1.24
  Bottom 0.4: v48.5,88 53.75,88 ULN2803.3 | v33.62,75.38 v41.5,83.25
SOL4  (via drill 0.4)
  Top 0.4: v17.5,76.75 12,71.25 v12,50.88 | v10.12,49 8.38,47.25 8.38,46.12 4.75,42.5 4.75,10.5 7.12,8.12 8.9,8.12 9.5,7.53 v9.5,6.75 | B1.25 31.12,5 31.12,3.1 30.27,2.25 v21.88,2.25
  Bottom 0.4: v17.5,76.75 19.5,76.75 20,77.25 20,78.5 25.75,84.25 47.25,84.25 48,85 53.25,85 53.75,85.5 ULN2803.4 | v10.12,49 v12,50.88 | v9.5,6.75 14,2.25 v21.88,2.25
SOL5  (via drill 0.4)
  Top 0.4: v63.25,82.62 69.62,76.25 v69.62,28.62 | v42.38,22.75 33.75,14.12 33.75,7.62 B1.26
  Bottom 0.4: v63.25,82.62 54.25,82.62 53.88,83 ULN2803.5 | v69.62,28.62 67.25,26.25 63.62,26.25 60.12,22.75 v42.38,22.75
SOL6  (via drill 0.4)
  Top 0.4: v60.75,80.12 67.38,73.5 67.38,53.12 66.88,52.62 66.88,41.12 66.62,40.88 v66.62,25.25 | v29,18 29.25,17.75 29.25,14.38 24.62,9.75 24.62,4.38 25.5,3.5 v30,3.5
  Bottom 0.4: v60.75,80.12 54.12,80.12 53.88,80.38 ULN2803.6 | v66.62,25.25 63.12,21.75 32.75,21.75 v29,18 | v30,3.5 32.12,3.5 33.62,5 B1.27
SOL7  (via drill 0.4)
  Top 0.4: v30.25,70.62 30,70.38 v30,13.75 | v34.75,13.75 36.12,12.38 36.12,7.62 B1.28
  Bottom 0.4: v30.25,70.62 36.25,76.62 47.25,76.62 48,77.38 53.25,77.38 53.75,77.88 ULN2803.7 | v34.75,13.75 v30,13.75
SOL8  (via drill 0.4)
  Top 0.4: v31.62,70.62 31,70 31,13.12 v27.12,9.25 | v23.62,9.12 23.88,8.88 v23.88,3.75
  Bottom 0.4: v31.62,70.62 35.12,74.12 52.5,74.12 53.75,75.38 ULN2803.8 | v27.12,9.25 27,9.12 v23.62,9.12 | v23.88,3.75 25.12,2.5 33.62,2.5 36.12,5 B1.29
SS1  (via drill 0.4)
  Top 0.4: v28.5,92.75 34.62,86.62 v34.62,20.75 | v51.5,14.25 52.62,13.12 52.62,8.75 51.5,7.62 B1.40
  Bottom 0.4: M1.J1.13 19.25,92.75 v28.5,92.75 | v34.62,20.75 41.12,14.25 v51.5,14.25
SS2  (via drill 0.4)
  Top 0.4: v98.5,21.75 92.38,15.62 88.62,15.62 88,15 v88,11.75 | v76.12,8.5 74.75,7.12 v74.75,5.62 | v74.75,2.88 73.38,1.5 52.3,1.5 51.5,2.3 51.5,5 B1.41
  Bottom 0.4: v98.5,21.75 98.88,21.75 98.88,90.75 96.75,92.88 M2.J1.13 | v88,11.75 84.75,8.5 v76.12,8.5 | v74.75,2.88 v74.75,5.62
TX  (via drill 0.4)
  Top 0.4: v51.38,41 51.38,29.62 51.25,29.5 51.25,28.75 52.75,27.25 54.38,27.25 SERIAL.4
  Bottom 0.4: v51.38,41 46.25,41 45.88,40.62 26.12,40.62 B1.1
(copper drawn outside any net)
  shapes: Top area x17

### Text on the board
tNames: IIUM ROBOTEAM
bNames: ROBOCON 2020